# EAGLE design 3sip_board (EAGLE 9.6.2)
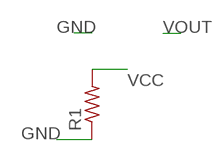
[diagram p0: schematic, sheet 1]

## Parts
R1  R-US_M1206  [M1206]

## Nets
GND: R1.1
VCC: R1.2

## Library data of the parts
R1 = rcl:R-US_: RESISTOR, American symbol; SPICEPREFIX: R

## Board
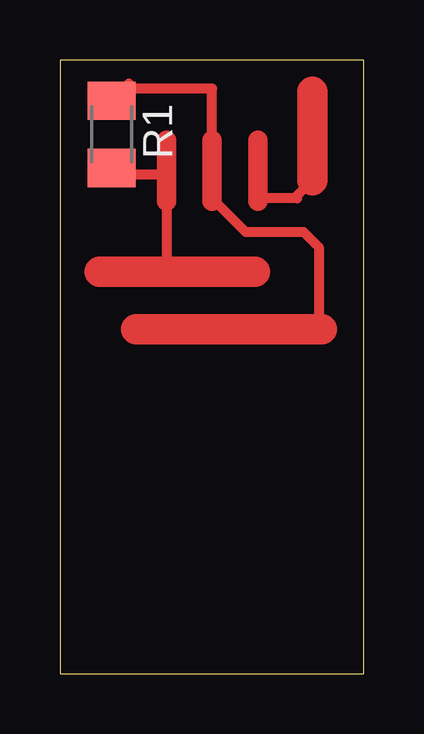
[diagram p1: board, top side]
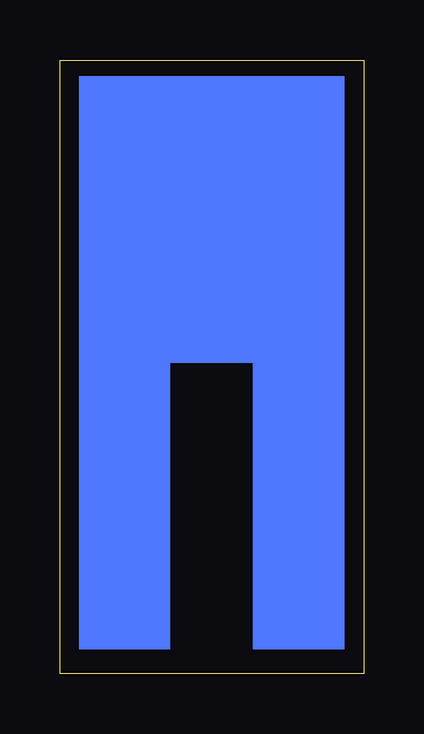
[diagram p2: board, bottom side, seen from below]

Size 12.68 x 25.58 mm. Coordinates in mm from the lower left corner, seen from the top.
Outline: 0,0 12.68,0 12.68,25.58 0,25.58 0,0
Copper layers (1*16): Top 0.035mm / dielectric 1.5mm / Bottom 0.035mm
Design rules "default": minimum track width 6mil, minimum drill 0.35mm, track to track 6mil, track to pad 6mil, pad to pad 6mil, via to via 6mil, smd to smd 6mil, copper to edge 40mil, drill to drill 6mil, minimum pad ring 10mil, minimum via ring 8mil, stop-mask expansion 4mil, vias tented up to drill 0mil, thermal gap 10mil

### Footprints (pad centres in the part's own frame; a part is rotated, then mirrored left to right if it is on the bottom)
M1206 = smd 1.6 x 2: 1 -1.4,0; 2 1.4,0

### Placement (x,y rotation side)
R1  2.16,22.48 270 top

### Tracks (layer width: path | path; a pad name or v marks a point on that pad's centre or on a via)
GND
  Top 0.406: R1.1 2.88,24.59
N$1
  Top 1.27: 1.65,16.76 8.13,16.76
N$2
  Top 0.406: 10.54,20.57 9.91,19.94
  Top 1.27: 10.54,20.57 10.54,24.26
N$3
  Top 0.406: 9.91,19.81 8.38,19.81
N$4
  Top 0.813: 6.35,22.23 6.35,19.68
N$5
  Top 0.813: 8.26,22.23 8.26,19.68
N$6
  Top 0.406: 4.45,19.68 4.45,16.76 4.57,16.64
  Top 0.813: 4.45,22.23 4.45,19.68
N$7
  Top 0.406: 6.48,19.68 7.75,18.41 10.16,18.41 10.79,17.78 10.79,14.35 10.79,14.22
  Top 1.27: 3.17,14.35 10.79,14.35 10.92,14.35
N$8
  Top 0.406: 2.79,20.83 4.32,20.83
N$9
  Top 0.406: 6.35,22.35 6.35,24.38 2.29,24.38
VCC
  Top 0.406: R1.2 2.54,21.46
(copper drawn outside any net)
  shapes: Bottom area x3